# EAGLE schematic stm32-discovery (EAGLE 7.3.0)
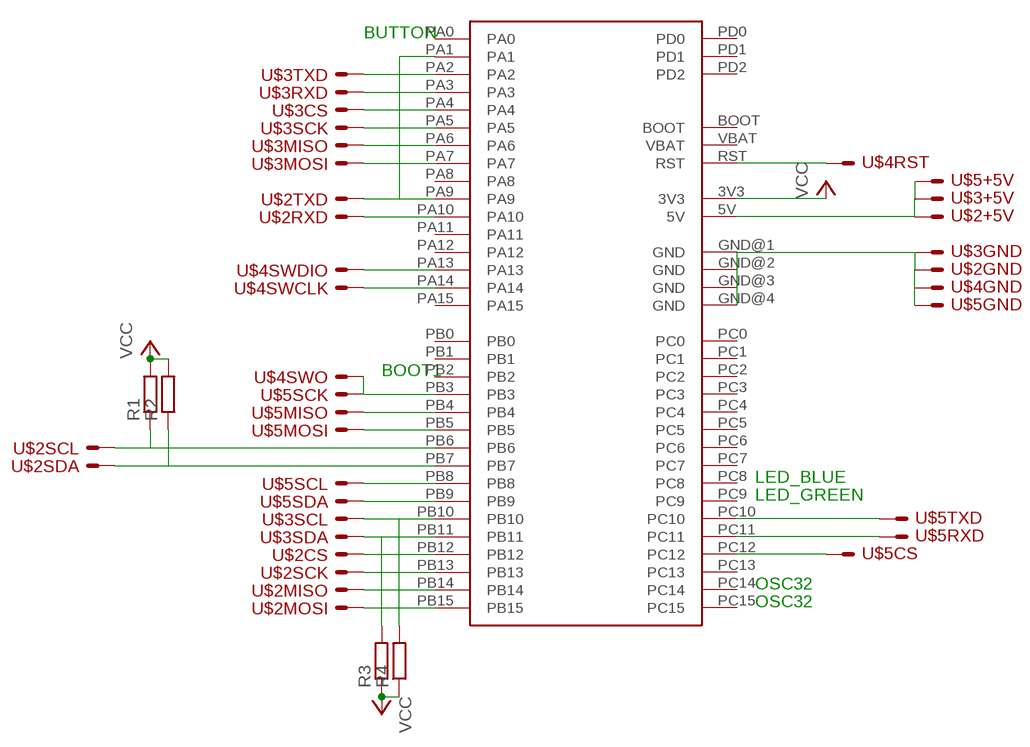
[diagram p0: schematic, sheet 1]

## Parts
R1  R-EU_0204/7  [0204/7]
R2  R-EU_0204/7  [0204/7]
R3  R-EU_0204/7  [0204/7]
R4  R-EU_0204/7  [0204/7]
U$1  STM32_DISCOVERY  [STM32_DISCOVERY]
U$2  SPI_BUS  [SPI_BUS]
U$3  SPI_BUS  [SPI_BUS]
U$4  SWD  [SWD]
U$5  SPI_BUS  [SPI_BUS]

## Nets
N$1: U$1.PA2 U$3.TXD
N$2: U$1.PA3 U$3.RXD
N$3: U$1.GND@1(GND) U$1.GND@2(GND) U$1.GND@3(GND) U$1.GND@4(GND) U$2.GND U$3.GND U$4.GND U$5.GND
N$4: U$1.5V U$2.+5V U$3.+5V U$5.+5V
N$5: U$1.PA4 U$3.CS
N$6: U$1.PA5 U$3.SCK
N$7: U$1.PA6 U$3.MISO
N$8: U$1.PA7 U$3.MOSI
N$9: R4.2 U$1.PB10 U$3.SCL
N$10: R3.2 U$1.PB11 U$3.SDA
N$11: U$1.PA1 U$1.PA9 U$2.TXD
N$12: U$1.PA10 U$2.RXD
N$13: U$1.PB12 U$2.CS
N$14: U$1.PB13 U$2.SCK
N$15: U$1.PB14 U$2.MISO
N$16: U$1.PB15 U$2.MOSI
N$17: R1.1 U$1.PB6 U$2.SCL
N$18: R2.1 U$1.PB7 U$2.SDA
N$19: U$1.PA13 U$4.SWDIO
N$20: U$1.PA14 U$4.SWCLK
N$21: U$1.RST U$4.RST
N$22: U$1.PB3 U$4.SWO U$5.SCK
N$23: U$1.PB8 U$5.SCL
N$24: U$1.PB9 U$5.SDA
N$25: U$1.PC10 U$5.TXD
N$26: U$1.PC11 U$5.RXD
N$27: U$1.PB4 U$5.MISO
N$28: U$1.PB5 U$5.MOSI
N$29: U$1.PC12 U$5.CS
VCC: R1.2 R2.2 R3.1 R4.1 U$1.3V3
Unconnected: U$1.BOOT U$1.NC@1(NC) U$1.NC@2(NC) U$1.PA0 U$1.PA8 U$1.PA11 U$1.PA12 U$1.PA15 U$1.PB0 U$1.PB1 U$1.PB2 U$1.PC0 U$1.PC1 U$1.PC2 U$1.PC3 U$1.PC4 U$1.PC5 U$1.PC6 U$1.PC7 U$1.PC8 U$1.PC9 U$1.PC13 U$1.PC14 U$1.PC15 U$1.PD0 U$1.PD1 U$1.PD2 U$1.VBAT

## Notes on the sheet
- BUTTON
- BOOT1
- LED_BLUE
- LED_GREEN
- OSC32
- OSC32

## Library data of the parts
R1-R4 = rcl:R-EU_: RESISTOR, European symbol
U$1 = stm32_discovery:STM32_DISCOVERY: STM32 Value line discovery
U$2 U$3 U$5 = lieven:SPI_BUS
U$4 = lieven:SWD